# EAGLE schematic VCALin (EAGLE 7.6.0)
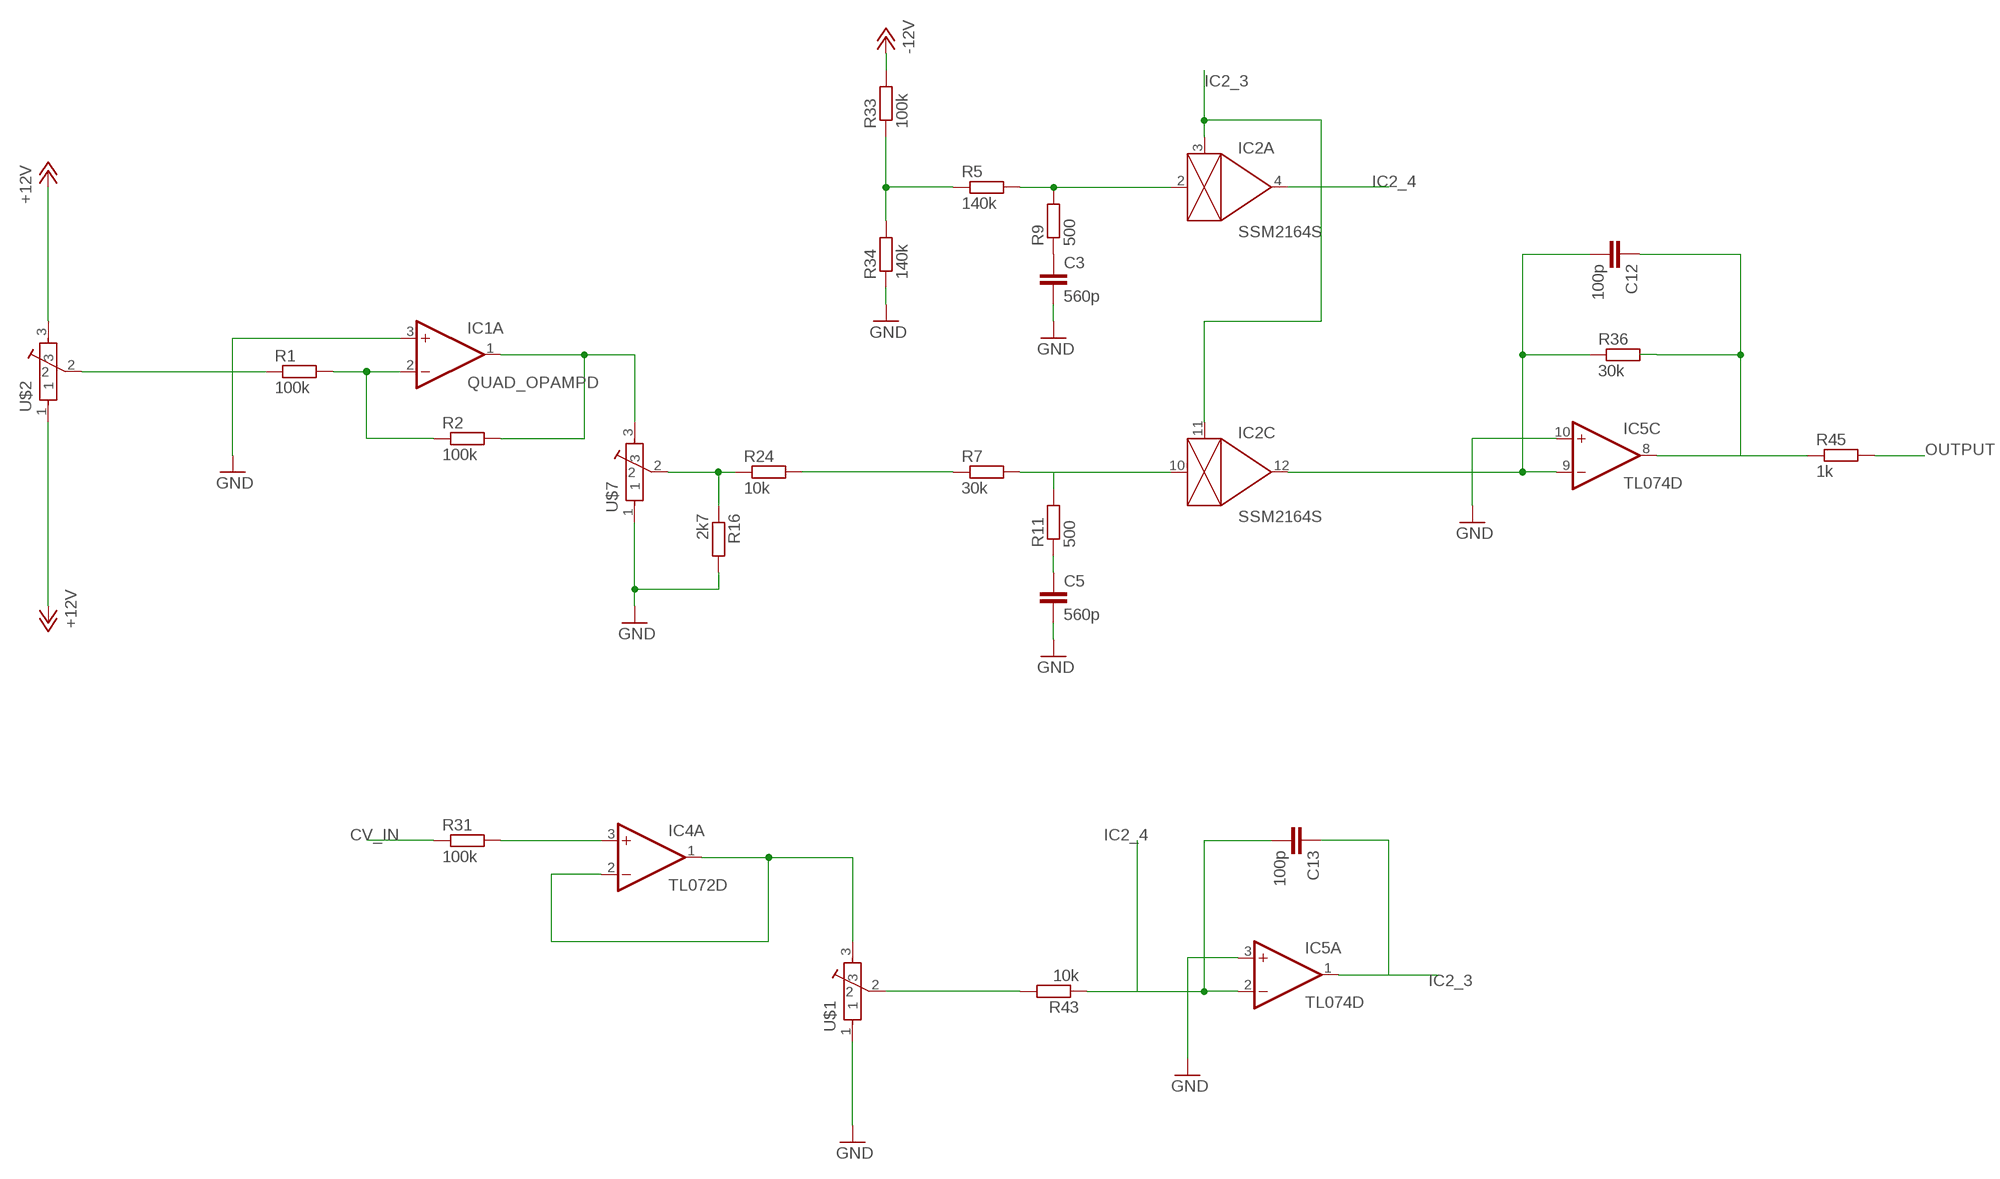
[diagram p0: schematic, sheet 1]

## Parts
C3  560p  C-EUC0603K  [C0603K]
C5  560p  C-EUC0603K  [C0603K]
C12  100p  C-EUC0603K  [C0603K]
C13  100p  C-EUC0603K  [C0603K]
IC1  QUAD_OPAMPD  [SO14]
IC2  SSM2164S  [SOIC16N]
IC4  TL072D  [SO08]
IC5  TL074D  [SO14]
R1  100k  R-EU_0603  [0603]
R2  100k  R-EU_0603  [0603]
R5  140k  R-EU_0603  [0603]
R7  30k  R-EU_0603  [0603]
R9  500  R-EU_0603  [0603]
R11  500  R-EU_0603  [0603]
R16  2k7  R-EU_0603  [0603]
R24  10k  R-EU_0603  [0603]
R31  100k  R-EU_0603  [0603]
R33  100k  R-EU_0603  [0603]
R34  140k  R-EU_0603  [0603]
R36  30k  R-EU_0603  [0603]
R43  10k  R-EU_0603  [0603]
R45  1k  R-EU_0603  [0603]
U$1  POT-ALPS-RK09L1140  [POT-ALPS-RK09L1140]
U$2  POT-ALPS-RK09L1140  [POT-ALPS-RK09L1140]
U$7  POT-ALPS-RK09L1140  [POT-ALPS-RK09L1140]

## Nets
+12V: U$2.1 U$2.3
-10V: R5.1 R33.1 R34.2
-12V: R33.2
CV_IN: R31.1
GND: C3.2 C5.2 IC1.3(A:+IN) IC5.3(A:+IN) IC5.10(C:+IN) R16.2 R34.1 U$1.1 U$7.1
IC2_3: C13.1 IC2.3(A:CTRL) IC2.11(C:CTRL) IC5.1(A:OUT)
IC2_4: C13.2 IC2.4(A:OUT) IC5.2(A:-IN) R43.1
N$1: IC1.1(A:OUT) R2.2 U$7.3
N$2: R1.1 U$2.2
N$3: IC1.2(A:-IN) R1.2 R2.1
N$18: IC2.2(A:IN) R5.2 R9.2
N$19: C5.1 R11.1
N$20: C3.1 R9.1
N$23: IC2.10(C:IN) R7.2 R11.2
N$26: R7.1 R24.2
N$34: R16.1 R24.1 U$7.2
N$39: IC4.3(A:+IN) R31.2
N$42: IC4.1(A:OUT) IC4.2(A:-IN) U$1.3
N$49: C12.2 IC2.12(C:OUT) IC5.9(C:-IN) R36.1
N$50: R43.2 U$1.2
N$51: C12.1 IC5.8(C:OUT) R36.2 R45.1
OUTPUT: R45.2
Unconnected: IC1.5(B:+IN) IC1.6(B:-IN) IC1.7(B:OUT) IC1.8(C:OUT) IC1.9(C:-IN) IC1.10(C:+IN) IC1.12(D:+IN) IC1.13(D:-IN) IC1.14(D:OUT) IC2.1(E:MODE) IC2.5(B:OUT) IC2.6(B:CTRL) IC2.7(B:IN) IC2.13(D:OUT) IC2.14(D:CTRL) IC2.15(D:IN) IC4.5(B:+IN) IC4.6(B:-IN) IC4.7(B:OUT) IC5.5(B:+IN) IC5.6(B:-IN) IC5.7(B:OUT) IC5.12(D:+IN) IC5.13(D:-IN) IC5.14(D:OUT) U$1.P$5 U$1.P$6 U$2.P$5 U$2.P$6 U$7.P$5 U$7.P$6

## Power pins joined to a net without a drawn wire
GND: IC2.8(E:GND)
V+: IC1.4(P:V+) IC2.16(E:V+) IC4.8(P:V+) IC5.4(P:V+)
V-: IC1.11(P:V-) IC2.9(E:V-) IC4.4(P:V-) IC5.11(P:V-)

## Library data of the parts
C3 C5 C12 C13 = resistor:C-EU: CAPACITOR, European symbol
IC1 = adafruit:QUAD_OPAMP: OP AMP Standard quad package
IC2 = ssm2164:SSM2164
IC4 = linear:TL072: OP AMP
IC5 = linear:TL074: OP AMP
R1 R2 R5 R7 R9 R11 R16 R24 R31 R33 R34 R36 R43 R45 = Rebel:R-EU_: RESISTOR, European symbol
U$1 U$2 U$7 = Rebel:POT-ALPS-RK09L